# EAGLE design e22-breakout (EAGLE 9.2.2)
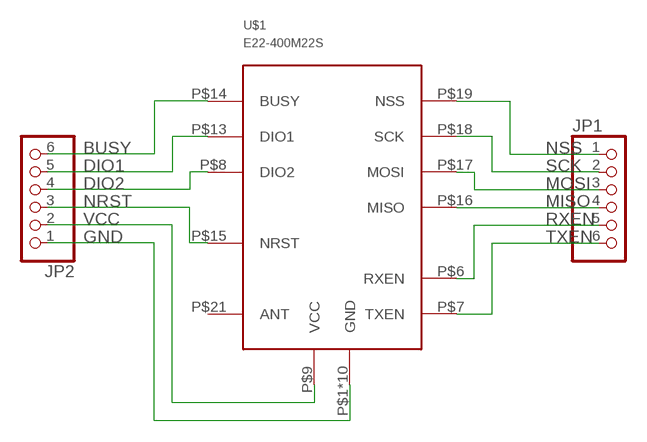
[diagram p0: schematic, sheet 1]

## Parts
JP1  PINHD-1X6  [1X06]
JP2  PINHD-1X6  [1X06]
U$1  E22-400M22S  [E22-400M22S]

## Nets
BUSY: JP2.6 U$1.P$14(BUSY)
DIO1: JP2.5 U$1.P$13(DIO1)
DIO2: JP2.4 U$1.P$8(DIO2)
GND [power]: JP2.1 U$1.P$1(GND) U$1.P$2(GND) U$1.P$3(GND) U$1.P$4(GND) U$1.P$5(GND) U$1.P$10(GND) U$1.P$11(GND) U$1.P$12(GND) U$1.P$20(GND) U$1.P$22(GND)
MISO: JP1.4 U$1.P$16(MISO)
MOSI: JP1.3 U$1.P$17(MOSI)
NRST: JP2.3 U$1.P$15(NRST)
NSS: JP1.1 U$1.P$19(NSS)
RXEN: JP1.5 U$1.P$6(RXEN)
SCK: JP1.2 U$1.P$18(SCK)
TXEN: JP1.6 U$1.P$7(TXEN)
VCC [power]: JP2.2 U$1.P$9(VCC)
Unconnected: U$1.P$21(ANT)

## Library data of the parts
JP1 JP2 = pinhead:PINHD-1X6: PIN HEADER
U$1 = ebyte-radio:E22-400M22S: EBYTE E22400M22S radio module Datasheet and info: http://www.ebyte.com/en/product-view-news.aspx?id=436

## Net classes
0 default: width 0.2 mm, drill 0.5 mm, clearance 0.2 mm
1 power: width 0.2 mm, drill 0.5 mm, clearance 0.2 mm

## Board
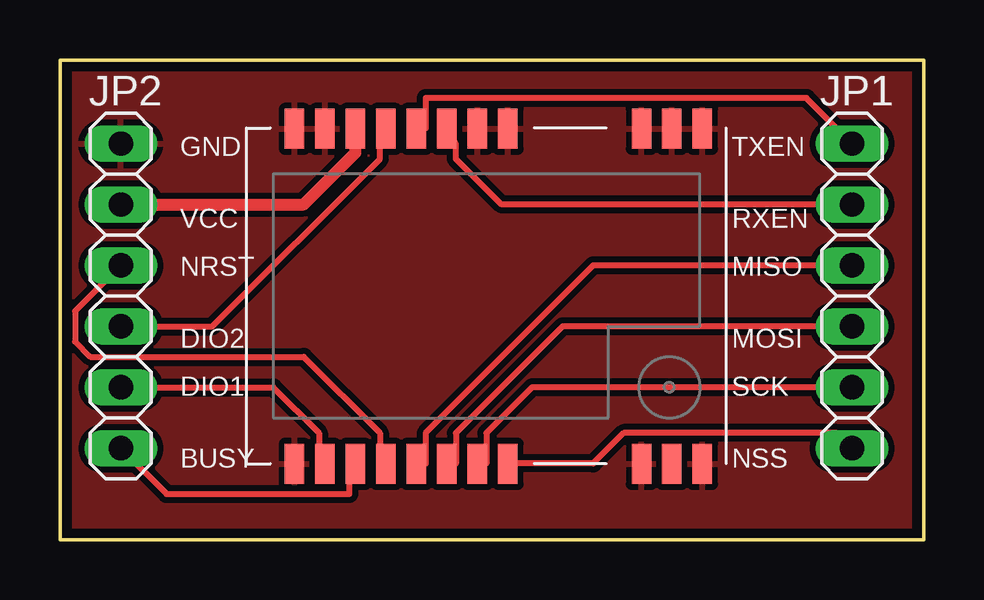
[diagram p1: board, top side]
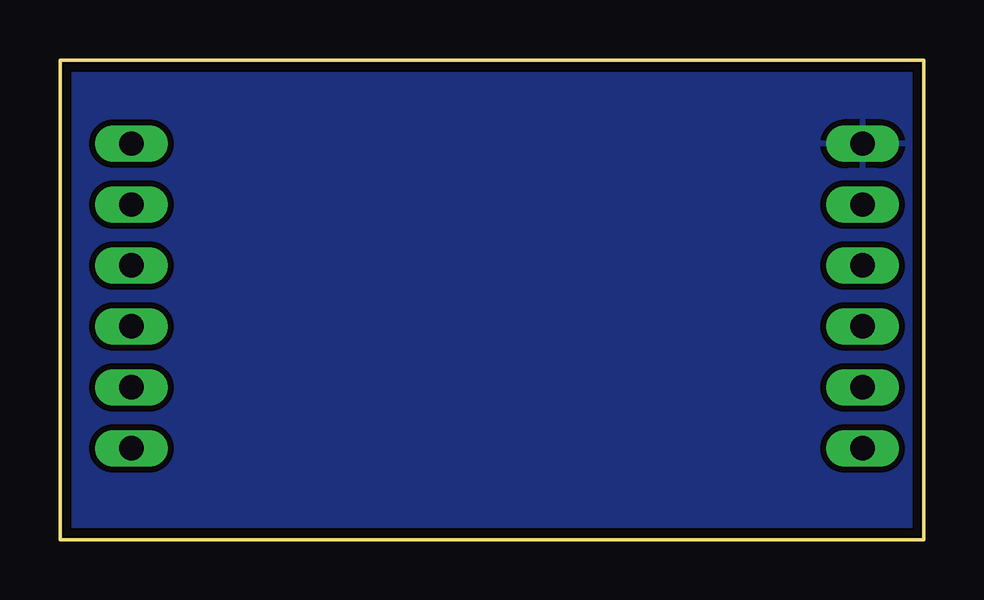
[diagram p2: board, bottom side, seen from below]

Size 36 x 20 mm. Coordinates in mm from the lower left corner, seen from the top.
Outline: 0,20 0,0 36,0 36,20 0,20
Copper layers (1*16): Top 0.035mm / dielectric 1mm / Bottom 0.035mm
Design rules "rezonit": minimum track width 0.2mm, minimum drill 0.5mm, track to track 0.25mm, track to pad 0.25mm, pad to pad 0.25mm, via to via 0.25mm, smd to smd 0.2mm, copper to edge 0.4mm, drill to drill 0.4mm, minimum pad ring 0.25mm, minimum via ring 0.25mm, stop-mask expansion 4mil, vias tented up to drill 0mil, thermal gap 10mil

### Footprints (pad centres in the part's own frame; a part is rotated, then mirrored left to right if it is on the bottom)
1X06 = drill 1.016 long: 1 -6.35,0; 2 -3.81,0; 3 -1.27,0; 4 1.27,0; 5 3.81,0; 6 6.35,0
E22-400M22S = smd 0.813 x 1.676: P$1 -9,-6.97; P$2 -7.73,-6.97; P$3 -6.46,-6.97; P$4 -0.89,-6.97; P$5 0.38,-6.97; P$6 1.65,-6.97; P$7 2.92,-6.97; P$8 4.19,-6.97; P$9 5.46,-6.97; P$10 6.73,-6.97; P$11 8,-6.97; P$12 8,7; P$13 6.73,7; P$14 5.46,7; P$15 4.19,7; P$16 2.92,7; P$17 1.65,7; P$18 0.38,7; P$19 -0.89,7; P$20 -6.46,7; P$21 -7.73,7; P$22 -9,7

### Placement (x,y rotation side)
JP1  33.02,10.16 90 top
JP2  2.54,10.16 270 top
U$1  17.78,10.16 180 top

### Tracks (layer width: path | path; a pad name or v marks a point on that pad's centre or on a via)
BUSY
  Top 0.254: JP2.6 4.45,1.91 12.06,1.91 12.06,2.54 U$1.P$14
DIO1
  Top 0.254: JP2.5 8.89,6.35 10.79,4.45 10.79,3.17 U$1.P$13
DIO2
  Top 0.254: JP2.4 6.35,8.89 13.34,15.88 13.34,16.51 U$1.P$8
GND
  pour Top: 0,20 0,0 36,0 36,20
  pour Bottom: 0,20 0,0 36,0 36,20
MISO
  Top 0.254: JP1.4 22.23,11.43 15.24,4.45 15.24,3.17 U$1.P$16
MOSI
  Top 0.254: JP1.3 20.95,8.89 16.51,4.45 16.51,3.17 U$1.P$17
NRST
  Top 0.254: JP2.3 0.64,9.53 0.64,8.26 1.27,7.62 10.16,7.62 13.34,4.45 13.34,3.17 U$1.P$15
NSS
  Top 0.254: JP1.1 32.38,4.45 23.5,4.45 22.23,3.17 19.05,3.17 U$1.P$19
RXEN
  Top 0.254: JP1.5 18.41,13.97 16.51,15.88 16.51,16.51 U$1.P$6
SCK
  Top 0.254: JP1.2 19.68,6.35 17.78,4.45 17.78,3.17 U$1.P$18
TXEN
  Top 0.254: JP1.6 31.11,18.41 15.24,18.41 15.24,17.14 U$1.P$7
VCC
  Top 0.5: JP2.2 10.16,13.97 12.32,16.13 U$1.P$9

### Text on the board
tPlace: GND | TXEN | VCC | RXEN | NRST | MISO | DIO2 | MOSI | DIO1 | SCK | BUSY | NSS